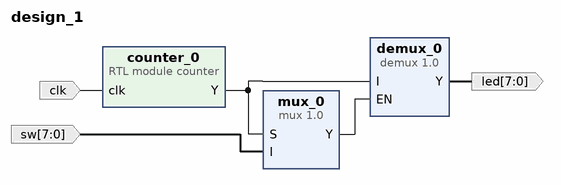
[diagram p0: block diagram of the top level]
# Vivado block design design_1, xc7a35tcpg236-1, Vivado 2022.1
create_bd_design design_1

create_bd_port -dir I -from 7 -to 0 sw
create_bd_port -dir O -from 7 -to 0 led
create_bd_port -dir I -type clk clk

create_bd_cell -type ip -vlnv xilinx.com:user:mux:1.0 mux_0
create_bd_cell -type ip -vlnv xilinx.com:user:demux:1.0 demux_0
create_bd_cell -type module -reference counter counter_0

# ---- connections ----

connect_bd_net -net I_0_1 [get_bd_ports sw] [get_bd_pins mux_0/I]
connect_bd_net -net clk_0_1 [get_bd_ports clk] [get_bd_pins counter_0/clk]
connect_bd_net [get_bd_pins counter_0/Y] [get_bd_pins mux_0/S] [get_bd_pins demux_0/I]
connect_bd_net [get_bd_pins demux_0/Y] [get_bd_ports led]
connect_bd_net [get_bd_pins mux_0/Y] [get_bd_pins demux_0/EN]

validate_bd_design
save_bd_design
